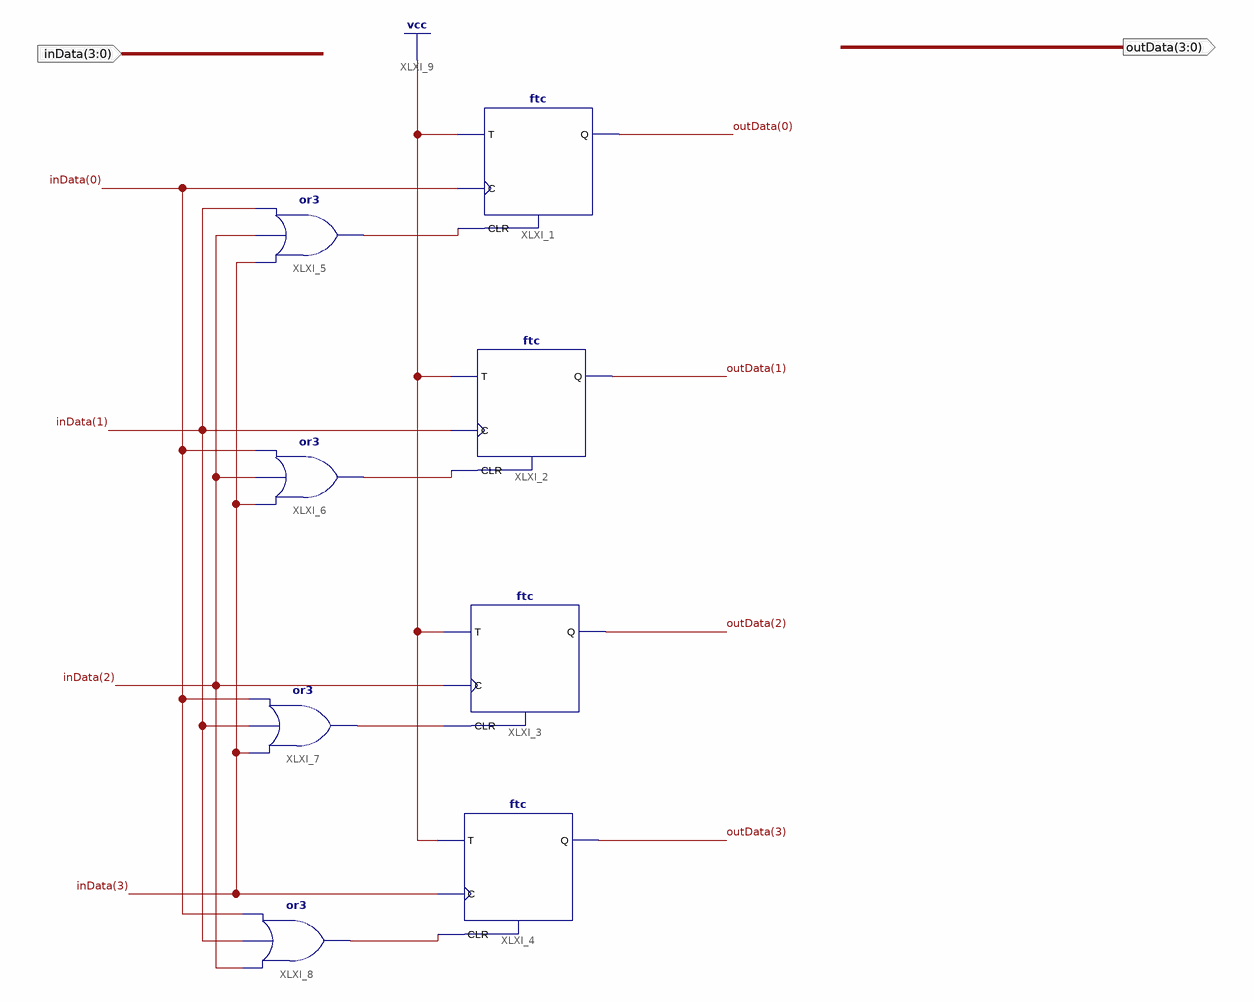
[diagram p0: schematic sheet 1]
// Xilinx ISE schematic FlipFlop.sch (spartan6) as structural Verilog: 8 symbols, 2 ports
module FlipFlop (
  input  [3:0] inData,
  output [3:0] outData
);

  wire XLXN_11, XLXN_12, XLXN_13, XLXN_14;

  or XLXI_5 (XLXN_11, inData[3], inData[2], inData[1]);
  or XLXI_6 (XLXN_12, inData[3], inData[2], inData[0]);
  or XLXI_7 (XLXN_13, inData[3], inData[1], inData[0]);
  or XLXI_8 (XLXN_14, inData[2], inData[1], inData[0]);
  ftc XLXI_4 (.C(inData[3]), .CLR(XLXN_14), .T(1'b1), .Q(outData[3]));
  ftc XLXI_3 (.C(inData[2]), .CLR(XLXN_13), .T(1'b1), .Q(outData[2]));
  ftc XLXI_2 (.C(inData[1]), .CLR(XLXN_12), .T(1'b1), .Q(outData[1]));
  ftc XLXI_1 (.C(inData[0]), .CLR(XLXN_11), .T(1'b1), .Q(outData[0]));
endmodule
